# Altium project Chassis-Rx-PCB(STM32).PrjPcb
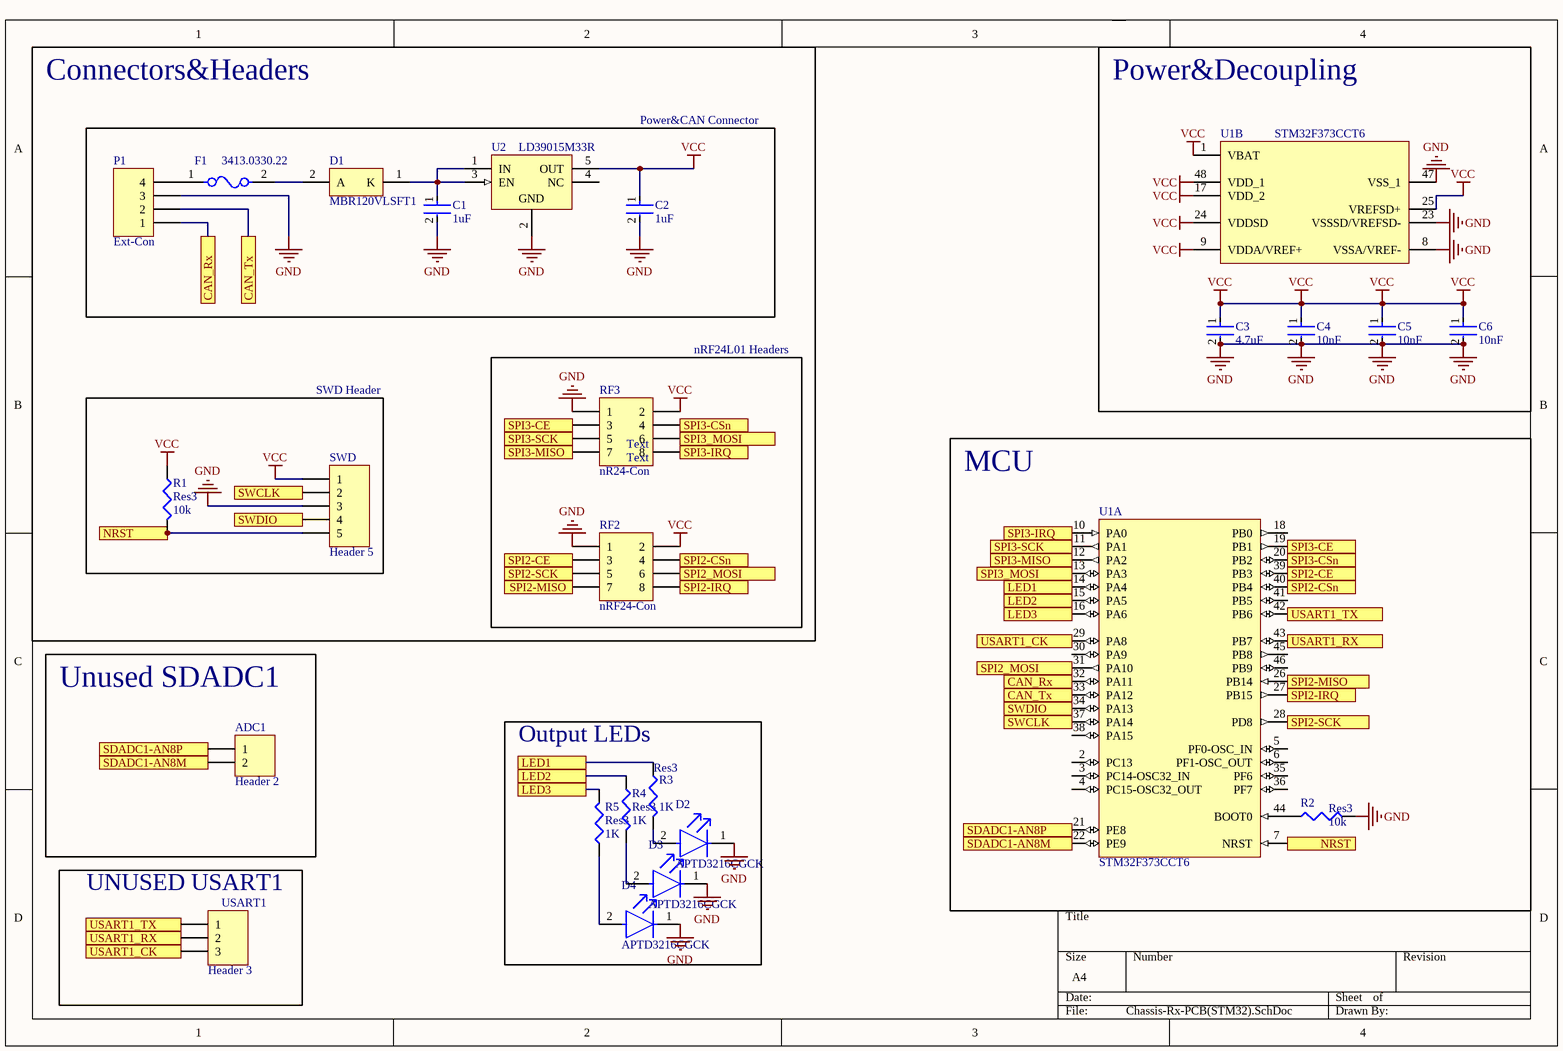
[diagram p0: Chassis-Rx-PCB(STM32).SchDoc]
1 sheet, 24 parts. Net scope: flat (ports and power ports of the same name join across sheets).

## Sheet Chassis-Rx-PCB(STM32).SchDoc
size A4

### Parts
ADC1  Header 2  [HDR1X2]
C1  1uF  [FP-C0805C-DN-MFG]
C2  1uF  [FP-C0805C-DN-MFG]
C3  4.7uF  [FP-C0805C-DN-MFG]
C4  10nF  [FP-C0805C-DN-MFG]
C5  10nF  [FP-C0805C-DN-MFG]
C6  10nF  [FP-C0805C-DN-MFG]
D1  MBR120VLSFT1  [ONSC-SOD-123FL-2-498-01_V]
D2  APTD3216CGCK  [FP-APTD3216CGCK-MFG]
D3  APTD3216CGCK  [FP-APTD3216CGCK-MFG]
D4  APTD3216CGCK  [FP-APTD3216CGCK-MFG]
F1  3413.0330.22  [FP-3413_0330_22-MFG]
P1  Ext-Con  [HDR1X4H]
R1  Res3  value 10k  [J1-0603]
R2  Res3  value 10k  [J1-0603]
R3  Res3  value 1K  [J1-0603]
R4  Res3  value 1K  [J1-0603]
R5  Res3  value 1K  [J1-0603]
RF2  nRF24-Con  [HDR2X4]
RF3  nR24-Con  [HDR2X4]
SWD  Header 5  [HDR1X5]
U1  STM32F373CCT6  [STM-LQFP48_L]  (parts A,B of 2)
U2  LD39015M33R  [SOT23-5L_M]
USART1  Header 3  [HDR1X3]

### Blocks framed on the sheet
Connectors&Headers: RF2 RF3
Power&Decoupling: C3-C6 U1
Power&CAN Connector: C1 C2 D1 F1 P1 U2
SWD Header: R1 SWD
MCU: R2 U1
Unused SDADC1: ADC1
Output LEDs: D2-D4 R3-R5
UNUSED USART1: USART1

### Ports
CAN_Rx, CAN_Tx, LED1, LED2, LED3, NRST, SDADC1-AN8M, SDADC1-AN8P, SPI2-CE, SPI2-CE (out), SPI2-CSn, SPI2-CSn (out), SPI2-IRQ, SPI2-MISO, SPI2-SCK, SPI2_MOSI, SPI3-CE, SPI3-CE (out), SPI3-CSn, SPI3-CSn (out), SPI3-IRQ, SPI3-MISO, SPI3-SCK, SPI3_MOSI, SWCLK, SWDIO, USART1_CK, USART1_RX, USART1_TX

### Nets
GND: C1.2 C2.2 C3.2 C4.2 C5.2 C6.2 D2.1(C) D3.1(C) D4.1(C) P1.3 R2.2 RF2.1 RF3.1 SWD.3 U1.8(VSSA/VREF-) U1.23(VSSSD/VREFSD-) U1.47(VSS_1) U2.2(GND)
VCC: C2.1 C3.1 C4.1 C5.1 C6.1 R1.1 RF2.2 RF3.2 SWD.1 U1.1(VBAT) U1.9(VDDA/VREF+) U1.17(VDD_2) U1.24(VDDSD) U1.25(VREFSD+) U1.48(VDD_1) U2.5(OUT)
NetADC1_1: ADC1.1 U1.21(PE8) ; port SDADC1-AN8P
NetADC1_2: ADC1.2 U1.22(PE9) ; port SDADC1-AN8M
NetC1_1: C1.1 D1.1(K) U2.1(IN) U2.3(EN)
NetD1_2: D1.2(A) F1.2
NetD2_2: D2.2(A) R3.2
NetD3_2: D3.2(A) R4.2
NetD4_2: D4.2(A) R5.1
NetF1_1: F1.1 P1.4
NetP1_1: P1.1 U1.32(PA11) ; port CAN_Rx
NetP1_2: P1.2 U1.33(PA12) ; port CAN_Tx
NetR1_2: R1.2 SWD.5 U1.7(NRST) ; port NRST
NetR2_1: R2.1 U1.44(BOOT0)
NetR3_1: R3.1 U1.14(PA4) ; port LED1
NetR4_1: R4.1 U1.15(PA5) ; port LED2
NetR5_2: R5.2 U1.16(PA6) ; port LED3
NetRF2_3: RF2.3 U1.39(PB3) ; port SPI2-CE
NetRF2_4: RF2.4 U1.40(PB4) ; port SPI2-CSn
NetRF2_5: RF2.5 U1.28(PD8) ; port SPI2-SCK
NetRF2_6: RF2.6 U1.31(PA10) ; port SPI2_MOSI
NetRF2_7: RF2.7 U1.26(PB14) ; port SPI2-MISO
NetRF2_8: RF2.8 U1.27(PB15) ; port SPI2-IRQ
NetRF3_3: RF3.3 U1.19(PB1) ; port SPI3-CE
NetRF3_4: RF3.4 U1.20(PB2) ; port SPI3-CSn
NetRF3_5: RF3.5 U1.11(PA1) ; port SPI3-SCK
NetRF3_6: RF3.6 U1.13(PA3) ; port SPI3_MOSI
NetRF3_7: RF3.7 U1.12(PA2) ; port SPI3-MISO
NetRF3_8: RF3.8 U1.10(PA0) ; port SPI3-IRQ
NetSWD_2: SWD.2 U1.37(PA14) ; port SWCLK
NetSWD_4: SWD.4 U1.34(PA13) ; port SWDIO
NetU1_29: U1.29(PA8) USART1.3 ; port USART1_CK
NetU1_42: U1.42(PB6) USART1.1 ; port USART1_TX
NetU1_43: U1.43(PB7) USART1.2 ; port USART1_RX

Not connected (* = marked no-connect by the designer): U1 2(PC13) 3(PC14-OSC32_IN) 4(PC15-OSC32_OUT) 5(PF0-OSC_IN) 6(PF1-OSC_OUT) 18(PB0) 30(PA9) 35(PF6) 36(PF7) 38(PA15) 41(PB5) 45(PB8) 46(PB9); U2 4(NC)

### Notes on the sheet
- nRF24L01 Headers
- (near RF3) Text

### Library data of the parts
ADC1 = Header 2: Header, 2-Pin; LatestRevisionDate: 17-Jul-2002; LatestRevisionNote: Re-released for DXP Platform.; Publisher: Altium Limited
C1-C6 = CMP-1036-04552-2: CAP CER 0.22UF 50V X7R 0805; Manufacturer: KEMET; Manufacturer Part Number: C0805C224K5RACTU; Value: 0.22 μF; Temperature Coefficient: 30ppm/°C; Material: Ceramic; Tolerance: 0.1; ComponentLink2URL: https://content.kemet.com/datasheets/KEM_C1003_C0G_SMD.pdf; Temperature Characteristic: X7R; Device Class L3: Ceramic Capacitors; Lead Free: Yes; Temperature: -55°C to +125°C; RoHS: TRUE; Capacitance: 0.22 μF; Automotive: No; Octopart: https://octopart.com/c0805c224k5ractu-kemet-144670; Temperature Range Low: -55°C; Height: 0.88mm; Device Class L1: Passive Components; Digikey Description: CAP CER 0.22UF 50V X7R 0805; ComponentLink2Description: Datasheet; Mouser Description: CAP CER 0.22UF 50V X7R 0805; Category: Cap; Ipc Land Pattern Name: CAPC200125X78; Temperature Range High: +125°C; Package: C0805C-DN; Device Class L2: Capacitors; Voltage Rating: 50 V
D1 = CMP-1055-00448-1: Schottky Power Rectifier, 2-Pin SOD-123, Tape and Reel; Manufacturer: On Semiconductor; Configuration: Single; IFSM Max (A): 45; Mounting Technology: Surface Mount; ComponentLink2Description: Datasheet; PackageDescription: 2-Pin SOD, Body 1.65 x 2.7 mm; PackageReference: SOD-123FL-2-498-01; RoHS: FALSE; ComponentLink3Description: Package Specification; PartNumber: MBR120VLSFT1; ComponentLink2URL: http://www.onsemi.cn/pub_link/Collateral/MBR120VLSFT1-D.PDF; PackageVersion: Rev. A; Packing: Tape and Reel; DatasheetVersion: Rev. 2; ComponentLink1Description: Manufacturer URL; ComponentLink3URL: http://www.onsemi.cn/pub_link/Collateral/MBR120VLSFT1-D.PDF; ComponentLink1URL: http://www.onsemi.com/
D2-D4 = CMP-2000-05792-2: LED GREEN CLEAR 2SMD; Forward Voltage: 2.1V; Forward Current: 20mA; Luminous Intensity: 300mcd; Number of LEDs: 1; Dominant Wavelength: 570nm; Viewing Angle: 50°; Lead Free: Lead Free; Lens Color: Clear; Mount: Surface Mount; Package Quantity: 2000; Height: 1.8mm; Number of Pins: 2; Test Current: 20mA; Case Code (Metric): 3216; Case/Package: 1206; Case Code (Imperial): 1206; Illumination Color: Green; Color: Green; Width: 1.6mm; Packaging: Tape and Reel; Min Operating Temperature: -40°C; Lens Style: Clear; Max Operating Temperature: 85°C; Length: 3.2mm
F1 = CMP-26293-000001-1: FUSE BOARD MNT 15A 32VAC 63VDC; Manufacturer: Schurter Inc; Max Fuse Ac Voltage: 32V; Fuse Voltage Drop: 57mV; Value: 3.5mΩ; Voltage Rating: 63V; Fuse Blow Speed: Slow; Fuse Interrupt Dc Current: 100A; Fuse I2T: 65A2Sec; Automotive: No; Ambient Temperature Range High: +90°C; RoHS: TRUE; Digikey Description: FUSE BOARD MNT 15A 32VAC 63VDC; Height: 0.6mm; Manufacturer Part Number: 3413.0330.22; Mouser Description: Surface Mount Fuses UST 1206 FUSE 15A F; Device Class L1: Circuit Protection; Ipc Land Pattern Name: CAPC320160X60; ComponentLink2URL: https://us.schurter.com/en/datasheet/typ_UST_1206.pdf; Resistance: 3.5mΩ; ComponentLink2Description: Datasheet; Octopart: https://octopart.com/3413.0330.22-schurter-8400836; Max Fuse Dc Voltage: 63V; Fuse Current: 15A; Category: Fuse; Device Class L3: unset; Package: 0; Ambient Temperature Range Low: -55°C; Device Class L2: Fuses; Lead Free: Yes
P1 = Header 4H: Header, 4-Pin, Right Angle; LatestRevisionDate: 17-Jul-2002; LatestRevisionNote: Re-released for DXP Platform.; Publisher: Altium Limited
R1-R5 = Res3: Resistor; Published: 8-Jun-2000; LatestRevisionDate: 29-May-2009; LatestRevisionNote: IPC-7351 Footprint Added.; PackageReference: J1-0603; Publisher: Altium Limited; PackageDescription: Chip Resistor
RF2 RF3 = Header 4X2: Header, 4-Pin, Dual row; LatestRevisionDate: 17-Jul-2002; LatestRevisionNote: Re-released for DXP Platform.; Publisher: Altium Limited
SWD = Header 5: Header, 5-Pin; LatestRevisionDate: 17-Jul-2002; LatestRevisionNote: Re-released for DXP Platform.; Publisher: Altium Limited
U1 = CMP-0572-00021-2: ARM Cortex-M4 32-bit MCU, 256 KB Flash, 32 KB Internal RAM, 36 I/Os, 48-pin LQFP, -40 to 85 degC, Tray; FLASH Size (Prog) (kB): 256; Internal RAM Size (kB): 32; Operating Frequency(F) (Processor speed) (MHz): 72; I/Os (High Current): 36; Supply Voltage(Vcc) min (V): 2; Mounting Technology: Surface Mount; ComponentLink2Description: Datasheet; PackageReference: LQFP48; Packing: Tray; PackageVersion: Rev. 6, 06/2013; ComponentLink1Description: Manufacturer URL; ComponentLink3Description: Package Specification; ComponentLink2URL: http://www.st.com/st-web-ui/static/active/en/resource/technical/document/datasheet/DM00046749.pdf; PartNumber: STM32F373CCT6; Core: ARM Cortex-M4; ComponentLink1URL: http://www.st.com/web/en/home.html; ComponentLink3URL: http://www.st.com/st-web-ui/static/active/en/resource/technical/document/datasheet/DM00058181.pdf; DatasheetVersion: Rev. 3; PackageDescription: 48-Pin Low Profile Quad Flat Package, 7 x 7 mm Body, 0.5 mm Pitch
U2 = CMP-0244-00351-1: 150 mA Low Quiescent Current Low Noise Voltage Regulator, 3.3V, 5-Pin SOT-23, Tape and Reel; PackageReference: SOT23-5L; ComponentLink1URL: http://www.st.com; PackageDescription: 5-Pin SOT-23 Package, 2.9 x 1.6 mm Body, 0.95 mm Pitch, 2.8 mm Lead Span; ComponentLink2Description: Datasheet; DatasheetVersion: 1/02/2009; ComponentLink1Description: Manufacturer URL; ComponentLink2URL: http://www.st.com/internet/com/TECHNICAL_RESOURCES/TECHNICAL_LITERATURE/DATASHEET/CD00173477.pdf; PackageVersion: 1/01/2008
USART1 = Header 3: Header, 3-Pin; LatestRevisionDate: 17-Jul-2002; LatestRevisionNote: Re-released for DXP Platform.; Publisher: Altium Limited